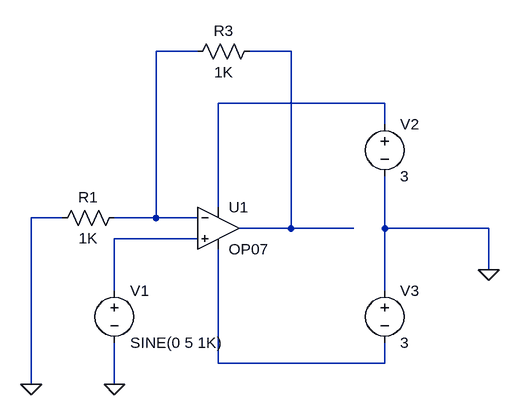
[diagram p0: schematic spice3e.asc]
spice3e.asc, the LTspice schematic file:
Version 4
SHEET 1 1784 1204
WIRE 384 -288 320 -288
WIRE 528 -288 464 -288
WIRE 672 -208 416 -208
WIRE 672 -176 672 -208
WIRE 416 -48 416 -208
WIRE 176 -32 128 -32
WIRE 320 -32 320 -288
WIRE 320 -32 256 -32
WIRE 384 -32 320 -32
WIRE 528 -16 528 -288
WIRE 528 -16 448 -16
WIRE 624 -16 528 -16
WIRE 672 -16 672 -96
WIRE 832 -16 672 -16
WIRE 384 0 256 0
WIRE 832 48 832 -16
WIRE 256 80 256 0
WIRE 672 80 672 -16
WIRE 416 192 416 16
WIRE 672 192 672 160
WIRE 672 192 416 192
WIRE 128 224 128 -32
WIRE 256 224 256 160
FLAG 256 224 0
FLAG 832 48 0
FLAG 128 224 0
SYMBOL OpAmps\\OP07 416 -80 R0
SYMATTR InstName U1
SYMBOL voltage 256 64 R0
WINDOW 123 0 0 Left 0
WINDOW 39 0 0 Left 0
SYMATTR InstName V1
SYMATTR Value SINE(0 5 1K)
SYMBOL voltage 672 -192 R0
WINDOW 123 0 0 Left 0
WINDOW 39 0 0 Left 0
SYMATTR InstName V2
SYMATTR Value 3
SYMBOL voltage 672 64 R0
WINDOW 123 0 0 Left 0
WINDOW 39 0 0 Left 0
SYMATTR InstName V3
SYMATTR Value 3
SYMBOL res 272 -48 R90
WINDOW 0 0 56 VBottom 2
WINDOW 3 32 56 VTop 2
SYMATTR InstName R1
SYMATTR Value 1K
SYMBOL res 480 -304 R90
WINDOW 0 0 56 VBottom 2
WINDOW 3 32 56 VTop 2
SYMATTR InstName R3
SYMATTR Value 1K

The netlist it stands for:
* spice3e.asc
XU1 N004 N001 N003 N005 N002 LT1001  ; OP07, pins In+ In- V+ V- OUT
V1 N004 0 SINE(0 5 1K)
V2 N003 0 3
V3 0 N005 3
R1 N001 0 1K
R3 N002 N001 1K
.lib LTC.lib
.backanno
.end